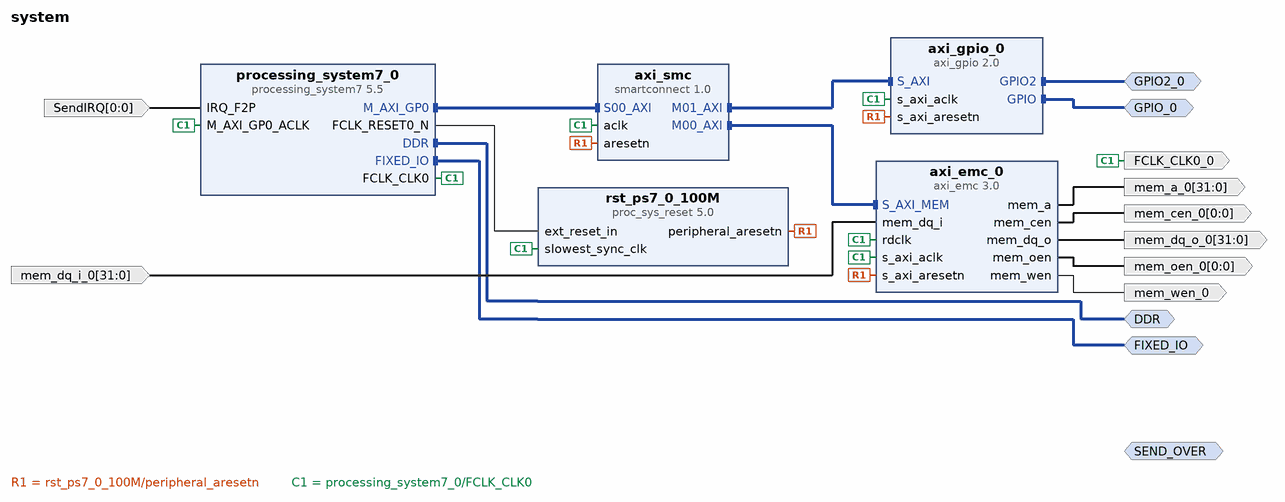
[diagram p0: block diagram of the top level]
# Vivado block design system, xc7z035ffg676-2, Vivado 2017.4
create_bd_design system

create_bd_intf_port -mode Master -vlnv xilinx.com:interface:ddrx_rtl:1.0 DDR
create_bd_intf_port -mode Master -vlnv xilinx.com:display_processing_system7:fixedio_rtl:1.0 FIXED_IO
create_bd_intf_port -mode Master -vlnv xilinx.com:interface:gpio_rtl:1.0 GPIO_0
create_bd_intf_port -mode Master -vlnv xilinx.com:interface:gpio_rtl:1.0 GPIO2_0
create_bd_intf_port -mode Master -vlnv xilinx.com:interface:gpio_rtl:1.0 SEND_OVER
create_bd_port -dir O -from 31 -to 0 mem_a_0
create_bd_port -dir I -from 31 -to 0 mem_dq_i_0
create_bd_port -dir O -from 31 -to 0 mem_dq_o_0
create_bd_port -dir O -from 0 -to 0 mem_oen_0
create_bd_port -dir O mem_wen_0
create_bd_port -dir O -from 0 -to 0 mem_cen_0
create_bd_port -dir O -type clk FCLK_CLK0_0
create_bd_port -dir I -from 0 -to 0 -type intr SendIRQ
set_property -dict {CONFIG.PortWidth 1} [get_bd_ports SendIRQ]

create_bd_cell -type ip -vlnv xilinx.com:ip:processing_system7:5.5 processing_system7_0
set_property -dict [list \
  CONFIG.PCW_UART_PERIPHERAL_FREQMHZ 100 \
  CONFIG.PCW_FPGA0_PERIPHERAL_FREQMHZ 100 \
  CONFIG.PCW_USE_FABRIC_INTERRUPT 1 \
  CONFIG.PCW_IRQ_F2P_INTR 1 \
  CONFIG.PCW_PRESET_BANK1_VOLTAGE {LVCMOS 1.8V} \
  CONFIG.PCW_UIPARAM_DDR_PARTNO {MT41K256M16 RE-125} \
  CONFIG.PCW_ENET0_PERIPHERAL_ENABLE 1 \
  CONFIG.PCW_ENET0_ENET0_IO {MIO 16 .. 27} \
  CONFIG.PCW_ENET0_GRP_MDIO_ENABLE 1 \
  CONFIG.PCW_ENET0_GRP_MDIO_IO {MIO 52 .. 53} \
  CONFIG.PCW_UART1_PERIPHERAL_ENABLE 1 \
  CONFIG.PCW_UART1_UART1_IO {MIO 48 .. 49} \
] [get_bd_cells processing_system7_0]
# 89 more settings of processing_system7_0 are not shown: defaults, MIO pin electricals, DDR timing, and values the tool derives
create_bd_cell -type ip -vlnv xilinx.com:ip:axi_emc:3.0 axi_emc_0
set_property -dict [list \
  CONFIG.C_INCLUDE_DATAWIDTH_MATCHING_0 0 \
  CONFIG.C_MAX_MEM_WIDTH 32 \
  CONFIG.C_MEM0_WIDTH 32 \
] [get_bd_cells axi_emc_0]
create_bd_cell -type ip -vlnv xilinx.com:ip:smartconnect:1.0 axi_smc
set_property -dict {CONFIG.NUM_MI 2 CONFIG.NUM_SI 1} [get_bd_cells axi_smc]
create_bd_cell -type ip -vlnv xilinx.com:ip:proc_sys_reset:5.0 rst_ps7_0_100M
create_bd_cell -type ip -vlnv xilinx.com:ip:axi_gpio:2.0 axi_gpio_0
set_property -dict [list \
  CONFIG.C_GPIO_WIDTH 1 \
  CONFIG.C_GPIO2_WIDTH 1 \
  CONFIG.C_IS_DUAL 1 \
  CONFIG.C_ALL_OUTPUTS 1 \
  CONFIG.C_ALL_OUTPUTS_2 1 \
] [get_bd_cells axi_gpio_0]

# ---- connections ----

connect_bd_intf_net [get_bd_intf_pins processing_system7_0/M_AXI_GP0] [get_bd_intf_pins axi_smc/S00_AXI]
connect_bd_intf_net [get_bd_intf_pins axi_smc/M00_AXI] [get_bd_intf_pins axi_emc_0/S_AXI_MEM]
connect_bd_intf_net [get_bd_intf_pins axi_smc/M01_AXI] [get_bd_intf_pins axi_gpio_0/S_AXI]
connect_bd_intf_net [get_bd_intf_ports DDR] [get_bd_intf_pins processing_system7_0/DDR]
connect_bd_intf_net [get_bd_intf_ports FIXED_IO] [get_bd_intf_pins processing_system7_0/FIXED_IO]
connect_bd_intf_net [get_bd_intf_ports GPIO_0] [get_bd_intf_pins axi_gpio_0/GPIO]
connect_bd_intf_net [get_bd_intf_ports GPIO2_0] [get_bd_intf_pins axi_gpio_0/GPIO2]
connect_bd_net [get_bd_pins axi_emc_0/mem_a] [get_bd_ports mem_a_0]
connect_bd_net -net mem_dq_i_0_1 [get_bd_ports mem_dq_i_0] [get_bd_pins axi_emc_0/mem_dq_i]
connect_bd_net [get_bd_pins axi_emc_0/mem_dq_o] [get_bd_ports mem_dq_o_0]
connect_bd_net [get_bd_pins axi_emc_0/mem_oen] [get_bd_ports mem_oen_0]
connect_bd_net [get_bd_pins axi_emc_0/mem_wen] [get_bd_ports mem_wen_0]
connect_bd_net [get_bd_pins axi_emc_0/mem_cen] [get_bd_ports mem_cen_0]
connect_bd_net [get_bd_pins processing_system7_0/FCLK_RESET0_N] [get_bd_pins rst_ps7_0_100M/ext_reset_in]
connect_bd_net [get_bd_pins rst_ps7_0_100M/peripheral_aresetn] \
  [get_bd_pins axi_emc_0/s_axi_aresetn] [get_bd_pins axi_smc/aresetn] [get_bd_pins axi_gpio_0/s_axi_aresetn]
connect_bd_net [get_bd_pins processing_system7_0/FCLK_CLK0] \
  [get_bd_ports FCLK_CLK0_0] [get_bd_pins processing_system7_0/M_AXI_GP0_ACLK] [get_bd_pins axi_smc/aclk] \
  [get_bd_pins axi_emc_0/s_axi_aclk] [get_bd_pins rst_ps7_0_100M/slowest_sync_clk] [get_bd_pins axi_emc_0/rdclk] \
  [get_bd_pins axi_gpio_0/s_axi_aclk]
connect_bd_net -net IRQ_F2P_0_1 [get_bd_ports SendIRQ] [get_bd_pins processing_system7_0/IRQ_F2P]

# ---- address map ----
assign_bd_address -offset 0x41200000 -range 64K -target_address_space [get_bd_addr_spaces processing_system7_0/Data] [get_bd_addr_segs axi_gpio_0/S_AXI/Reg]
assign_bd_address -offset 0x60000000 -range 32M -target_address_space [get_bd_addr_spaces processing_system7_0/Data] [get_bd_addr_segs axi_emc_0/S_AXI_MEM/MEM0]

validate_bd_design
save_bd_design
